# Altium schematic sheet 13_Zynq PL.SchDoc
size A3; SheetNumber: 13; SheetTotal: 14
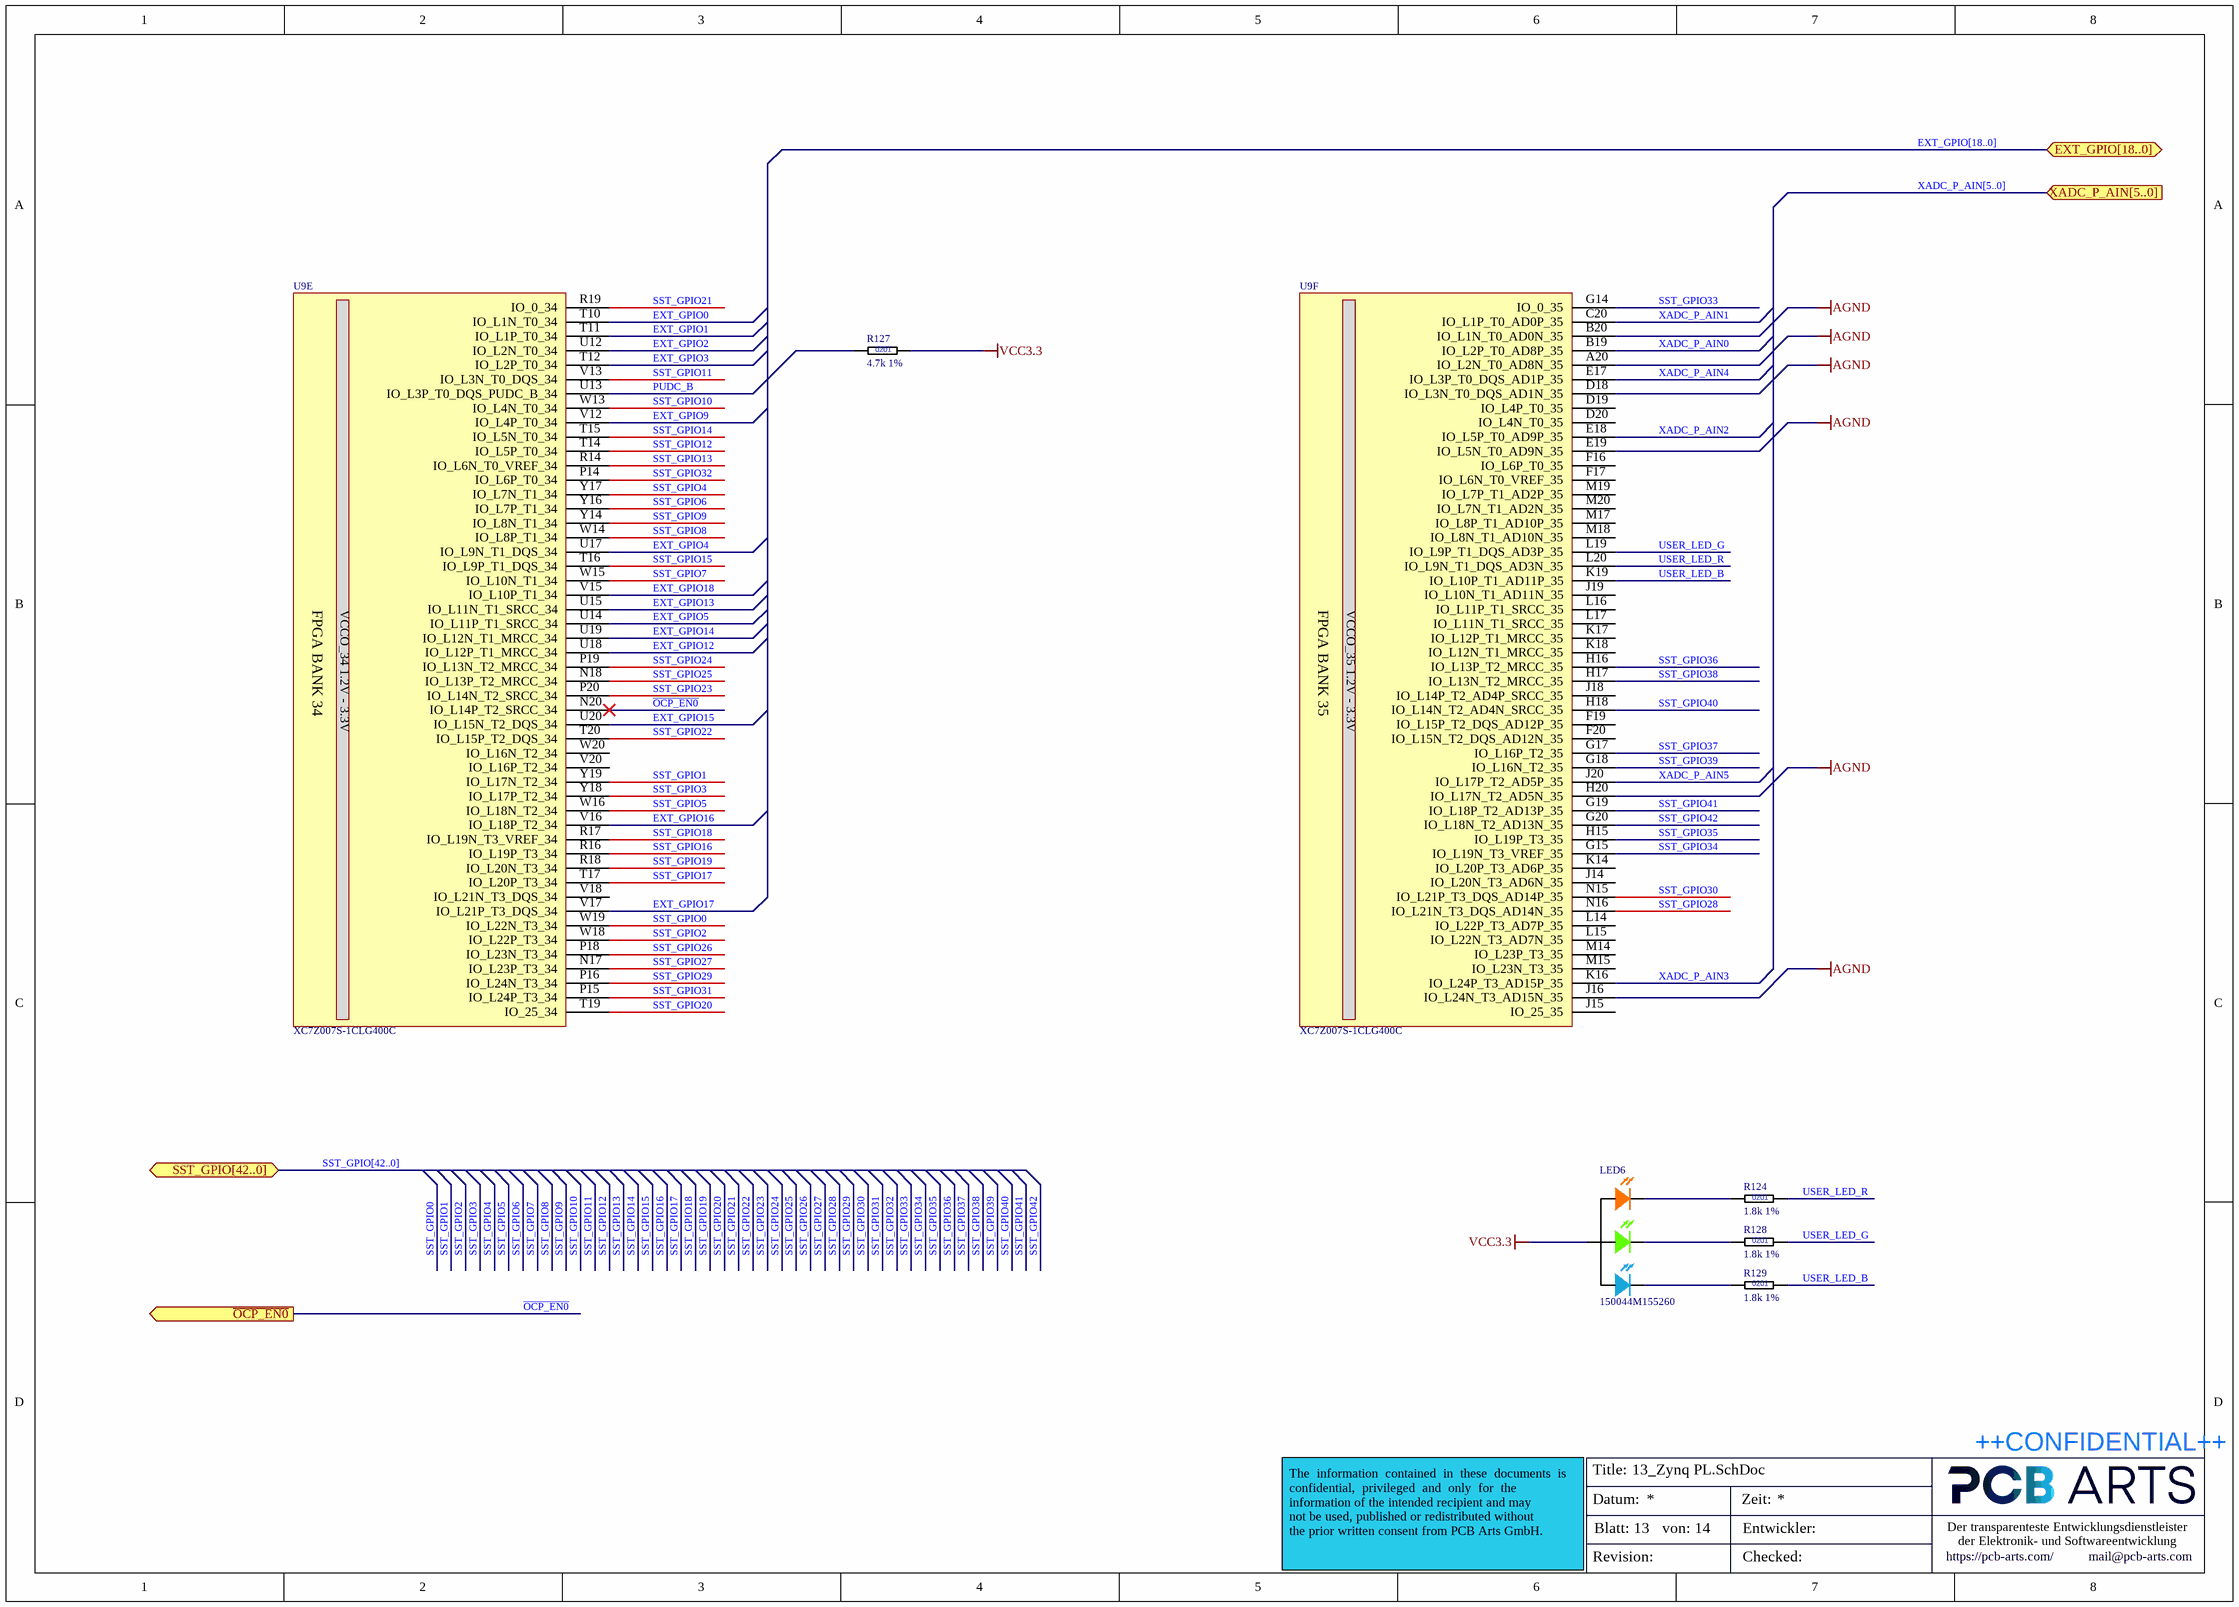
[diagram p0: 13_Zynq PL.SchDoc]

## Parts
LED6  150044M155260  [WL-SFCC SMT]
R124  1.8k 1%  [RESC0603X03L]
R127  4.7k 1%  [RESC0603X03L]
R128  1.8k 1%  [RESC0603X03L]
R129  1.8k 1%  [RESC0603X03L]
U9  XC7Z007S-1CLG400C  [BGA400C80P20X20_1700X1700X160]  (parts E,F of 8)

## Ports
EXT_GPIO[18..0] (bidir), SST_GPIO[42..0] (bidir), XADC_P_AIN[5..0] (in), ~{OCP_EN0} (out)

## Nets
AGND: U9.A20(IO_L2N_T0_AD8N_35) U9.B20(IO_L1N_T0_AD0N_35) U9.D18(IO_L3N_T0_DQS_AD1N_35) U9.E19(IO_L5N_T0_AD9N_35) U9.H20(IO_L17N_T2_AD5N_35) U9.J16(IO_L24N_T3_AD15N_35)
VCC3.3: LED6.1 R127.2
EXT_GPIO0: U9.T10(IO_L1N_T0_34)
EXT_GPIO1: U9.T11(IO_L1P_T0_34)
EXT_GPIO2: U9.U12(IO_L2N_T0_34)
EXT_GPIO3: U9.T12(IO_L2P_T0_34)
EXT_GPIO4: U9.U17(IO_L9N_T1_DQS_34)
EXT_GPIO5: U9.U14(IO_L11P_T1_SRCC_34)
EXT_GPIO9: U9.V12(IO_L4P_T0_34)
EXT_GPIO12: U9.U18(IO_L12P_T1_MRCC_34)
EXT_GPIO13: U9.U15(IO_L11N_T1_SRCC_34)
EXT_GPIO14: U9.U19(IO_L12N_T1_MRCC_34)
EXT_GPIO15: U9.U20(IO_L15N_T2_DQS_34)
EXT_GPIO16: U9.V16(IO_L18P_T2_34)
EXT_GPIO17: U9.V17(IO_L21P_T3_DQS_34)
EXT_GPIO18: U9.V15(IO_L10P_T1_34)
~{OCP_EN0}: U9.N20(IO_L14P_T2_SRCC_34) ; port ~{OCP_EN0}
PUDC_B: R127.1 U9.U13(IO_L3P_T0_DQS_PUDC_B_34)
SST_GPIO0: U9.W19(IO_L22N_T3_34)
SST_GPIO1: U9.Y19(IO_L17N_T2_34)
SST_GPIO2: U9.W18(IO_L22P_T3_34)
SST_GPIO3: U9.Y18(IO_L17P_T2_34)
SST_GPIO4: U9.Y17(IO_L7N_T1_34)
SST_GPIO5: U9.W16(IO_L18N_T2_34)
SST_GPIO6: U9.Y16(IO_L7P_T1_34)
SST_GPIO7: U9.W15(IO_L10N_T1_34)
SST_GPIO8: U9.W14(IO_L8P_T1_34)
SST_GPIO9: U9.Y14(IO_L8N_T1_34)
SST_GPIO10: U9.W13(IO_L4N_T0_34)
SST_GPIO11: U9.V13(IO_L3N_T0_DQS_34)
SST_GPIO12: U9.T14(IO_L5P_T0_34)
SST_GPIO13: U9.R14(IO_L6N_T0_VREF_34)
SST_GPIO14: U9.T15(IO_L5N_T0_34)
SST_GPIO15: U9.T16(IO_L9P_T1_DQS_34)
SST_GPIO16: U9.R16(IO_L19P_T3_34)
SST_GPIO17: U9.T17(IO_L20P_T3_34)
SST_GPIO18: U9.R17(IO_L19N_T3_VREF_34)
SST_GPIO19: U9.R18(IO_L20N_T3_34)
SST_GPIO20: U9.T19(IO_25_34)
SST_GPIO21: U9.R19(IO_0_34)
SST_GPIO22: U9.T20(IO_L15P_T2_DQS_34)
SST_GPIO23: U9.P20(IO_L14N_T2_SRCC_34)
SST_GPIO24: U9.P19(IO_L13N_T2_MRCC_34)
SST_GPIO25: U9.N18(IO_L13P_T2_MRCC_34)
SST_GPIO26: U9.P18(IO_L23N_T3_34)
SST_GPIO27: U9.N17(IO_L23P_T3_34)
SST_GPIO28: U9.N16(IO_L21N_T3_DQS_AD14N_35)
SST_GPIO29: U9.P16(IO_L24N_T3_34)
SST_GPIO30: U9.N15(IO_L21P_T3_DQS_AD14P_35)
SST_GPIO31: U9.P15(IO_L24P_T3_34)
SST_GPIO32: U9.P14(IO_L6P_T0_34)
SST_GPIO33: U9.G14(IO_0_35)
SST_GPIO34: U9.G15(IO_L19N_T3_VREF_35)
SST_GPIO35: U9.H15(IO_L19P_T3_35)
SST_GPIO36: U9.H16(IO_L13P_T2_MRCC_35)
SST_GPIO37: U9.G17(IO_L16P_T2_35)
SST_GPIO38: U9.H17(IO_L13N_T2_MRCC_35)
SST_GPIO39: U9.G18(IO_L16N_T2_35)
SST_GPIO40: U9.H18(IO_L14N_T2_AD4N_SRCC_35)
SST_GPIO41: U9.G19(IO_L18P_T2_AD13P_35)
SST_GPIO42: U9.G20(IO_L18N_T2_AD13N_35)
USER_LED_B: R129.2 U9.K19(IO_L10P_T1_AD11P_35)
USER_LED_G: R128.2 U9.L19(IO_L9P_T1_DQS_AD3P_35)
USER_LED_R: R124.2 U9.L20(IO_L9N_T1_DQS_AD3N_35)
XADC_P_AIN0: U9.B19(IO_L2P_T0_AD8P_35)
XADC_P_AIN1: U9.C20(IO_L1P_T0_AD0P_35)
XADC_P_AIN2: U9.E18(IO_L5P_T0_AD9P_35)
XADC_P_AIN3: U9.K16(IO_L24P_T3_AD15P_35)
XADC_P_AIN4: U9.E17(IO_L3P_T0_DQS_AD1P_35)
XADC_P_AIN5: U9.J20(IO_L17P_T2_AD5P_35)
NetLED6_2: LED6.2 R124.1
NetLED6_3: LED6.3 R128.1
NetLED6_4: LED6.4 R129.1

Not connected (* = marked no-connect by the designer): U9 D19(IO_L4P_T0_35) D20(IO_L4N_T0_35) F16(IO_L6P_T0_35) F17(IO_L6N_T0_VREF_35) F19(IO_L15P_T2_DQS_AD12P_35) F20(IO_L15N_T2_DQS_AD12N_35) J14(IO_L20N_T3_AD6N_35) J15(IO_25_35) J18(IO_L14P_T2_AD4P_SRCC_35) J19(IO_L10N_T1_AD11N_35) K14(IO_L20P_T3_AD6P_35) K17(IO_L12P_T1_MRCC_35) K18(IO_L12N_T1_MRCC_35) L14(IO_L22P_T3_AD7P_35) L15(IO_L22N_T3_AD7N_35) L16(IO_L11P_T1_SRCC_35) L17(IO_L11N_T1_SRCC_35) M14(IO_L23P_T3_35) M15(IO_L23N_T3_35) M17(IO_L8P_T1_AD10P_35) M18(IO_L8N_T1_AD10N_35) M19(IO_L7P_T1_AD2P_35) M20(IO_L7N_T1_AD2N_35) V18(IO_L21N_T3_DQS_34) V20(IO_L16P_T2_34) W20(IO_L16N_T2_34)

## Buses and harness runs
bus EXT_GPIO[18..0] = port EXT_GPIO[18..0]
bus SST_GPIO[42..0] = port SST_GPIO[42..0]
bus XADC_P_AIN[5..0] = port XADC_P_AIN[5..0]

## Notes on the sheet
- Title:
- ++CONFIDENTIAL++
- Datum:
- Blatt:
- von:
- Zeit:
- Entwickler:
- Der transparenteste Entwicklungsdienstleister
  der Elektronik- und Softwareentwicklung
- The  information  contained  in  these  documents  is  confidential,  privileged  and  only  for  the
  information of the intended recipient and may
  not be used, published or redistributed without
  the prior written consent from PCB Arts GmbH.
- Revision:
- Checked:
- https://pcb-arts.com/
- mail@pcb-arts.com
- (in symbol RES_0201_1.8k_1%) 0201
- (in symbol RES_0201_4.7k_1%) 0201
- (in symbol XC7Z007S-1CLG400C_Processors - Application Specialised, part E) FPGA BANK 34; VCCO_34 1.2V - 3.3V
- (in symbol XC7Z007S-1CLG400C_Processors - Application Specialised, part F) FPGA BANK 35; VCCO_35 1.2V - 3.3V

## Library data of the parts
LED6 = 150044M155260_SMD WL-SFCC SMT LED Full-color Chip: Standard LEDs - SMD WL-SFCC SMT LED Full-color Chip; Manufacturer 1: Würth Elektronik; Manufacturer 1 Prt. Nr.: 150044M155260
R124 R128 R129 = RES_0201_1.8k_1%: Thick Film Resistors - SMD 1.8K OHM 1%; Manufacturer 1: Panasonic; Manufacturer 1 Prt. Nr.: ERJ-1GNF1801C; Manufacturer 2 Prt. Nr.: CRCW02011K80FKED; Manufacturer 2: Vishay / Dale
R127 = RES_0201_4.7k_1%: Thick Film Resistors - SMD 4.7K OHM 1%; Manufacturer 1: Yageo; Manufacturer 1 Prt. Nr.: RC0201JR-074K7P; Manufacturer 2 Prt. Nr.: CRCW02014K70FNED; Manufacturer 2: Vishay / Dale
U9 = XC7Z007S-1CLG400C_Processors - Application Specialised: Manufacturer 1: Xilinx; Manufacturer 1 Prt. Nr.: XC7Z007S-1CLG400C